# EAGLE schematic hcgs-servo-slam (EAGLE 9.2.2)
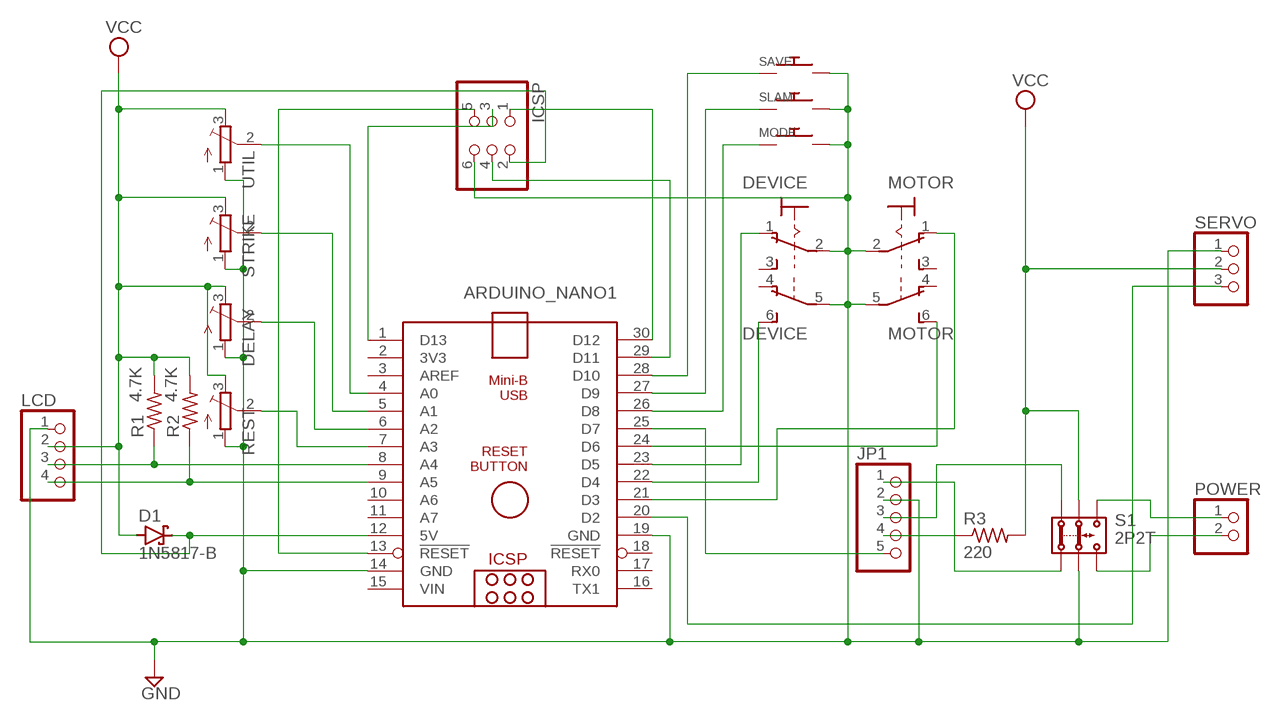
[diagram p0: schematic, sheet 1]

## Parts
ARDUINO_NANO1  ARDUINO_NANO_HCARDUINO_NANO_NO_HOLE  [ARDUINO_NANO_NO_HOLE]
D1  1N5817-B  [DO41-7.6]
DELAY  TRIMPOT3386  [TRIM-3386]
DEVICE  320-938  [320-938]
ICSP  PINHD-2X3  [2X03]
JP1  PINHD-1X5  [1X05]
LCD  PINHD-1X4  [1X04]
MODE  SWITCH_PUSHBUTTONEVQ-PE  [TACT_PANA-EVQ]
MOTOR  320-938  [320-938]
POWER  PINHD-1X2  [1X02]
R1  4.7K  R-US_0309/12  [0309/12]
R2  4.7K  R-US_0309/12  [0309/12]
R3  220  R-US_0309/12  [0309/12]
REST  TRIMPOT3386  [TRIM-3386]
S1  2P2T  [2P2T]
SAVE  SWITCH_PUSHBUTTONEVQ-PE  [TACT_PANA-EVQ]
SERVO  PINHD-1X3  [1X03]
SLAM  SWITCH_PUSHBUTTONEVQ-PE  [TACT_PANA-EVQ]
STRIKE  TRIMPOT3386  [TRIM-3386]
UTIL  TRIMPOT3386  [TRIM-3386]

## Nets
GND: ARDUINO_NANO1.14(GND) ARDUINO_NANO1.19(GND) DELAY.1(A) DEVICE.2(1:P) DEVICE.5(B:P) ICSP.6 JP1.2 LCD.1 MODE.P$2 MOTOR.2(1:P) MOTOR.5(B:P) REST.1(A) S1.2.2 SAVE.P$2 SERVO.1 SLAM.P$2 STRIKE.1(A) UTIL.1(A)
N$1: ARDUINO_NANO1.25(D7) JP1.5
N$2: JP1.4 R3.1
N$3: ARDUINO_NANO1.8(A4) LCD.3 R1.1
N$4: ARDUINO_NANO1.9(A5) LCD.4 R2.1
N$5: ARDUINO_NANO1.4(A0) UTIL.2(S)
N$6: ARDUINO_NANO1.5(A1) STRIKE.2(S)
N$7: ARDUINO_NANO1.6(A2) DELAY.2(S)
N$8: ARDUINO_NANO1.7(A3) REST.2(S)
N$9: ARDUINO_NANO1.24(D6) MOTOR.6(B:S)
N$10: ARDUINO_NANO1.22(D4) DEVICE.6(B:S)
N$11: ARDUINO_NANO1.23(D5) DEVICE.1(1:O)
N$12: ARDUINO_NANO1.21(D3) MOTOR.1(1:O)
N$13: ARDUINO_NANO1.27(D9) SLAM.P$1
N$14: ARDUINO_NANO1.26(D8) MODE.P$1
N$15: ARDUINO_NANO1.28(D10) SAVE.P$1
N$16: ARDUINO_NANO1.30(D12) ICSP.1
N$17: JP1.3 S1.1.1
N$18: ARDUINO_NANO1.1(D13) ICSP.3
N$19: ARDUINO_NANO1.29(D11) ICSP.4
N$20: ARDUINO_NANO1.13(!RESET) ICSP.5
N$21: JP1.1 S1.1.2
N$22: POWER.1 S1.3.1
N$24: POWER.2 S1.3.2
N$25: ARDUINO_NANO1.12(5V) D1.C ICSP.2
N$26: ARDUINO_NANO1.20(D2) SERVO.3
VCC: D1.A DELAY.3(E) LCD.2 R1.2 R2.2 R3.2 REST.3(E) S1.2.1 SERVO.2 STRIKE.3(E) UTIL.3(E)
Unconnected: ARDUINO_NANO1.2(3V3) ARDUINO_NANO1.3(AREF) ARDUINO_NANO1.10(A6) ARDUINO_NANO1.11(A7) ARDUINO_NANO1.16(TX1) ARDUINO_NANO1.17(RX0) ARDUINO_NANO1.18(!RESET) DEVICE.3(1:S) DEVICE.4(B:O) MOTOR.3(1:S) MOTOR.4(B:O)

## Power pins joined to a net without a drawn wire
VIN: ARDUINO_NANO1.15(VIN)

## Library data of the parts
ARDUINO_NANO1 = ArduinoNano_HC:ARDUINO_NANO_HC: Arduino Nano HC Overview: The Arduino Nano is a small, complete, and breadboard-friendly board based on the ATmega328 (Arduino Nano 3.x) or ATmega168 (Arduino Nano 2.x). It has more or less the same functionality of the Arduino Duemilanove, but in a different package. It lacks only a DC power jack, and works with a Mini-B USB cable instead of a standard one. The Nano was designed and is being produced by Gravitech. Specifications: Microcontroller Atmel ATmega168 or ATmega328 Operating Voltage (logic level) 5 V Input Voltage (recommended) 7-12 V Input Voltage (limits) 6-20 V Digital I/O Pins 14 (of which 6 provide PWM output) Analog Input Pins 8 DC Current per I/O Pin 40 mA Flash Memory 16 KB (ATmega168) or 32 KB (ATmega328) of which 2 KB used by bootloader SRAM 1 KB (ATmega168) or 2 KB (ATmega328) EEPROM 512 bytes (ATmega168) or 1 KB (ATmega328) Clock Speed 16 MHz Dimensions 0.73" x 1.70" Length 45 mm Width 18 mm Weigth 5 g Power: The Arduino Nano can be powered via the Mini-B USB connection, 6-20V unregulated external power supply (pin 30), or 5V regulated external power supply (pin 27). The power source is automatically selected to the highest voltage source. Memory: The ATmega168 has 16 KB of flash memory for storing code (of which 2 KB is used for the bootloader); the ATmega328 has 32 KB, (also with 2 KB used for the bootloader). The ATmega168 has 1 KB of SRAM and 512 bytes of EEPROM (which can be read and written with the EEPROM library); the ATmega328 has 2 KB of SRAM and 1 KB of EEPROM. Input and Output: Each of the 14 digital pins on the Nano can be used as an input or output, using pinMode(), digitalWrite(), and digitalRead() functions. They operate at 5 volts. Each pin can provide or receive a maximum of 40 mA and has an internal pull-up resistor (disconnected by default) of 20-50 kOhms. In addition, some pins have specialized functions. Visit Arduino - ArduinoBoardNano <https://www.arduino.cc/en/Main/ArduinoBoardNano>
D1 = diode:1N581*: 1.0A SCHOTTKY BARRIER RECTIFIER Source: http://www.diodes.com/datasheets/ds23001.pdf
DELAY REST STRIKE UTIL = adafruit:TRIMPOT: SMT trimmer potentiometer part number TC33X http://www.ladyada.net/library/eagle
DEVICE MOTOR = switch:320-938: TOGGLE SWITCH distributor RS Components
ICSP = pinhead:PINHD-2X3: PIN HEADER
JP1 = pinhead:PINHD-1X5: PIN HEADER
LCD = pinhead:PINHD-1X4: PIN HEADER
MODE SAVE SLAM = adafruit:SWITCH_PUSHBUTTON: Buttons SOFTTOUCHSMD_SJ - Soft touch temporary push button (Super Junk Akihabara) Compatible with SKPMANE010 [Mouser: 688-SKPMAN] C&K_KSS = Digikey: KSS221GLFS
POWER = pinhead:PINHD-1X2: PIN HEADER
R1-R3 = adafruit:R-US_: RESISTOR, American symbol
S1 = switch:2P2T: SLIDE SWITCH 2P2T Part No. SS-22F05-G(A)4 Source: CANAL ELECTRONIC CO., LTD .. switsch.pdf
SERVO = pinhead:PINHD-1X3: PIN HEADER